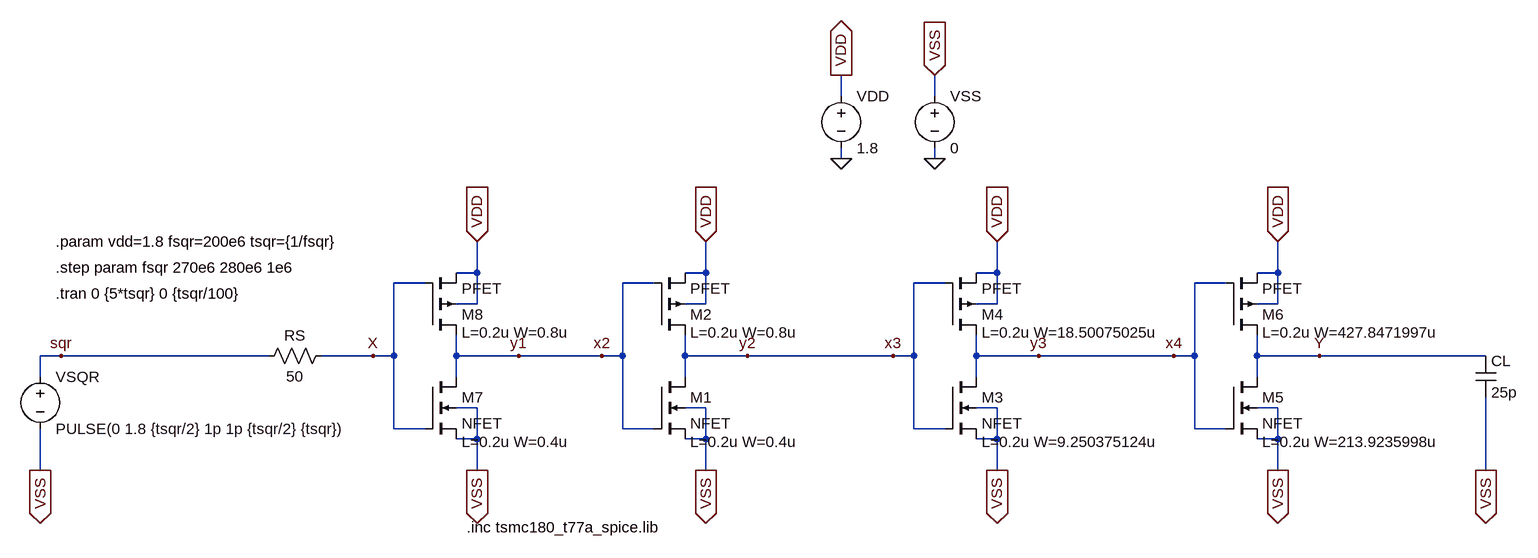
[diagram p0: schematic BUF-test.asc]
BUF-test.asc, the LTspice schematic file:
Version 4
SHEET 1 1496 680
WIRE 432 -288 432 -320
WIRE 576 -288 576 -320
WIRE 432 -192 432 -208
WIRE 576 -192 576 -208
WIRE -128 -16 -128 -64
WIRE -128 -16 -160 -16
WIRE 224 -16 224 -64
WIRE 224 -16 192 -16
WIRE 672 -16 672 -64
WIRE 672 -16 640 -16
WIRE 1104 -16 1104 -64
WIRE 1104 -16 1072 -16
WIRE -208 0 -256 0
WIRE 144 0 96 0
WIRE 592 0 544 0
WIRE 1024 0 976 0
WIRE -128 32 -128 -16
WIRE -128 32 -160 32
WIRE 224 32 224 -16
WIRE 224 32 192 32
WIRE 672 32 672 -16
WIRE 672 32 640 32
WIRE 1104 32 1104 -16
WIRE 1104 32 1072 32
WIRE -768 112 -800 112
WIRE -448 112 -768 112
WIRE -288 112 -368 112
WIRE -256 112 -256 0
WIRE -256 112 -288 112
WIRE -160 112 -160 80
WIRE -64 112 -160 112
WIRE 64 112 -64 112
WIRE 96 112 96 0
WIRE 96 112 64 112
WIRE 192 112 192 80
WIRE 288 112 192 112
WIRE 512 112 288 112
WIRE 544 112 544 0
WIRE 544 112 512 112
WIRE 640 112 640 80
WIRE 736 112 640 112
WIRE 944 112 736 112
WIRE 976 112 976 0
WIRE 976 112 944 112
WIRE 1072 112 1072 80
WIRE 1168 112 1072 112
WIRE 1424 112 1168 112
WIRE -800 144 -800 112
WIRE -160 144 -160 112
WIRE 192 144 192 112
WIRE 640 144 640 112
WIRE 1072 144 1072 112
WIRE -128 192 -160 192
WIRE 224 192 192 192
WIRE 672 192 640 192
WIRE 1104 192 1072 192
WIRE -256 224 -256 112
WIRE -208 224 -256 224
WIRE 96 224 96 112
WIRE 144 224 96 224
WIRE 544 224 544 112
WIRE 592 224 544 224
WIRE 976 224 976 112
WIRE 1024 224 976 224
WIRE -128 240 -128 192
WIRE -128 240 -160 240
WIRE 224 240 224 192
WIRE 224 240 192 240
WIRE 672 240 672 192
WIRE 672 240 640 240
WIRE 1104 240 1104 192
WIRE 1104 240 1072 240
WIRE -800 288 -800 224
WIRE -128 288 -128 240
WIRE 224 288 224 240
WIRE 672 288 672 240
WIRE 1104 288 1104 240
WIRE 1424 288 1424 176
FLAG 432 -192 0
FLAG 432 -320 VDD
IOPIN 432 -320 Out
FLAG 224 -64 VDD
IOPIN 224 -64 In
FLAG 64 112 x2
FLAG 288 112 y2
FLAG 672 -64 VDD
IOPIN 672 -64 In
FLAG 512 112 x3
FLAG 736 112 y3
FLAG 1104 -64 VDD
IOPIN 1104 -64 In
FLAG 944 112 x4
FLAG 1168 112 Y
FLAG -128 -64 VDD
IOPIN -128 -64 In
FLAG -288 112 X
FLAG -64 112 y1
FLAG -768 112 sqr
FLAG 576 -192 0
FLAG 576 -320 VSS
IOPIN 576 -320 In
FLAG -800 288 VSS
IOPIN -800 288 Out
FLAG -128 288 VSS
IOPIN -128 288 Out
FLAG 224 288 VSS
IOPIN 224 288 Out
FLAG 672 288 VSS
IOPIN 672 288 Out
FLAG 1104 288 VSS
IOPIN 1104 288 Out
FLAG 1424 288 VSS
IOPIN 1424 288 Out
SYMBOL nmos4 144 144 R0
WINDOW 123 56 100 Left 2
SYMATTR Value2 L=0.2u W=0.4u
SYMATTR InstName M1
SYMATTR Value NFET
SYMBOL pmos4 144 80 M180
WINDOW 123 56 4 Left 2
SYMATTR Value2 L=0.2u W=0.8u
SYMATTR InstName M2
SYMATTR Value PFET
SYMBOL voltage 432 -304 R0
SYMATTR InstName VDD
SYMATTR Value 1.8
SYMBOL nmos4 592 144 R0
WINDOW 123 56 100 Left 2
SYMATTR Value2 L=0.2u W=9.250375124u
SYMATTR InstName M3
SYMATTR Value NFET
SYMBOL pmos4 592 80 M180
WINDOW 123 56 4 Left 2
SYMATTR Value2 L=0.2u W=18.50075025u
SYMATTR InstName M4
SYMATTR Value PFET
SYMBOL nmos4 1024 144 R0
WINDOW 123 56 100 Left 2
SYMATTR Value2 L=0.2u W=213.9235998u
SYMATTR InstName M5
SYMATTR Value NFET
SYMBOL pmos4 1024 80 M180
WINDOW 123 56 4 Left 2
SYMATTR Value2 L=0.2u W=427.8471997u
SYMATTR InstName M6
SYMATTR Value PFET
SYMBOL nmos4 -208 144 R0
WINDOW 123 56 100 Left 2
SYMATTR Value2 L=0.2u W=0.4u
SYMATTR InstName M7
SYMATTR Value NFET
SYMBOL pmos4 -208 80 M180
WINDOW 123 56 4 Left 2
SYMATTR Value2 L=0.2u W=0.8u
SYMATTR InstName M8
SYMATTR Value PFET
SYMBOL res -352 96 R90
WINDOW 0 0 56 VBottom 2
WINDOW 3 32 56 VTop 2
SYMATTR InstName RS
SYMATTR Value 50
SYMBOL voltage -800 128 R0
WINDOW 123 0 0 Left 0
WINDOW 39 0 0 Left 0
SYMATTR InstName VSQR
SYMATTR Value PULSE(0 1.8 {tsqr/2} 1p 1p {tsqr/2} {tsqr})
SYMBOL voltage 576 -304 R0
WINDOW 123 0 0 Left 0
WINDOW 39 0 0 Left 0
SYMATTR InstName VSS
SYMATTR Value 0
SYMBOL cap 1408 112 R0
SYMATTR InstName CL
SYMATTR Value 25p
TEXT -144 376 Left 2 !.inc tsmc180_t77a_spice.lib
TEXT -776 -64 Left 2 !.param vdd=1.8 fsqr=200e6 tsqr={1/fsqr}
TEXT -776 16 Left 2 !.tran 0 {5*tsqr} 0 {tsqr/100}
TEXT -776 -24 Left 2 !.step param fsqr 270e6 280e6 1e6

The netlist it stands for:
* BUF-test.asc
M1 x3 y1 VSS VSS NFET L=0.2u W=0.4u
M2 x3 y1 VDD VDD PFET L=0.2u W=0.8u
VDD VDD 0 1.8
M3 x4 x3 VSS VSS NFET L=0.2u W=9.250375124u
M4 x4 x3 VDD VDD PFET L=0.2u W=18.50075025u
M5 Y x4 VSS VSS NFET L=0.2u W=213.9235998u
M6 Y x4 VDD VDD PFET L=0.2u W=427.8471997u
M7 y1 X VSS VSS NFET L=0.2u W=0.4u
M8 y1 X VDD VDD PFET L=0.2u W=0.8u
RS X sqr 50
VSQR sqr VSS PULSE(0 1.8 {tsqr/2} 1p 1p {tsqr/2} {tsqr})
VSS VSS 0 0
CL Y VSS 25p
.model NMOS NMOS
.model PMOS PMOS
.lib standard.mos
.inc tsmc180_t77a_spice.lib
.param vdd=1.8 fsqr=200e6 tsqr={1/fsqr}
.tran 0 {5*tsqr} 0 {tsqr/100}
.step param fsqr 270e6 280e6 1e6
.backanno
.end